# EAGLE design usb_blaster (EAGLE 7.3.0)
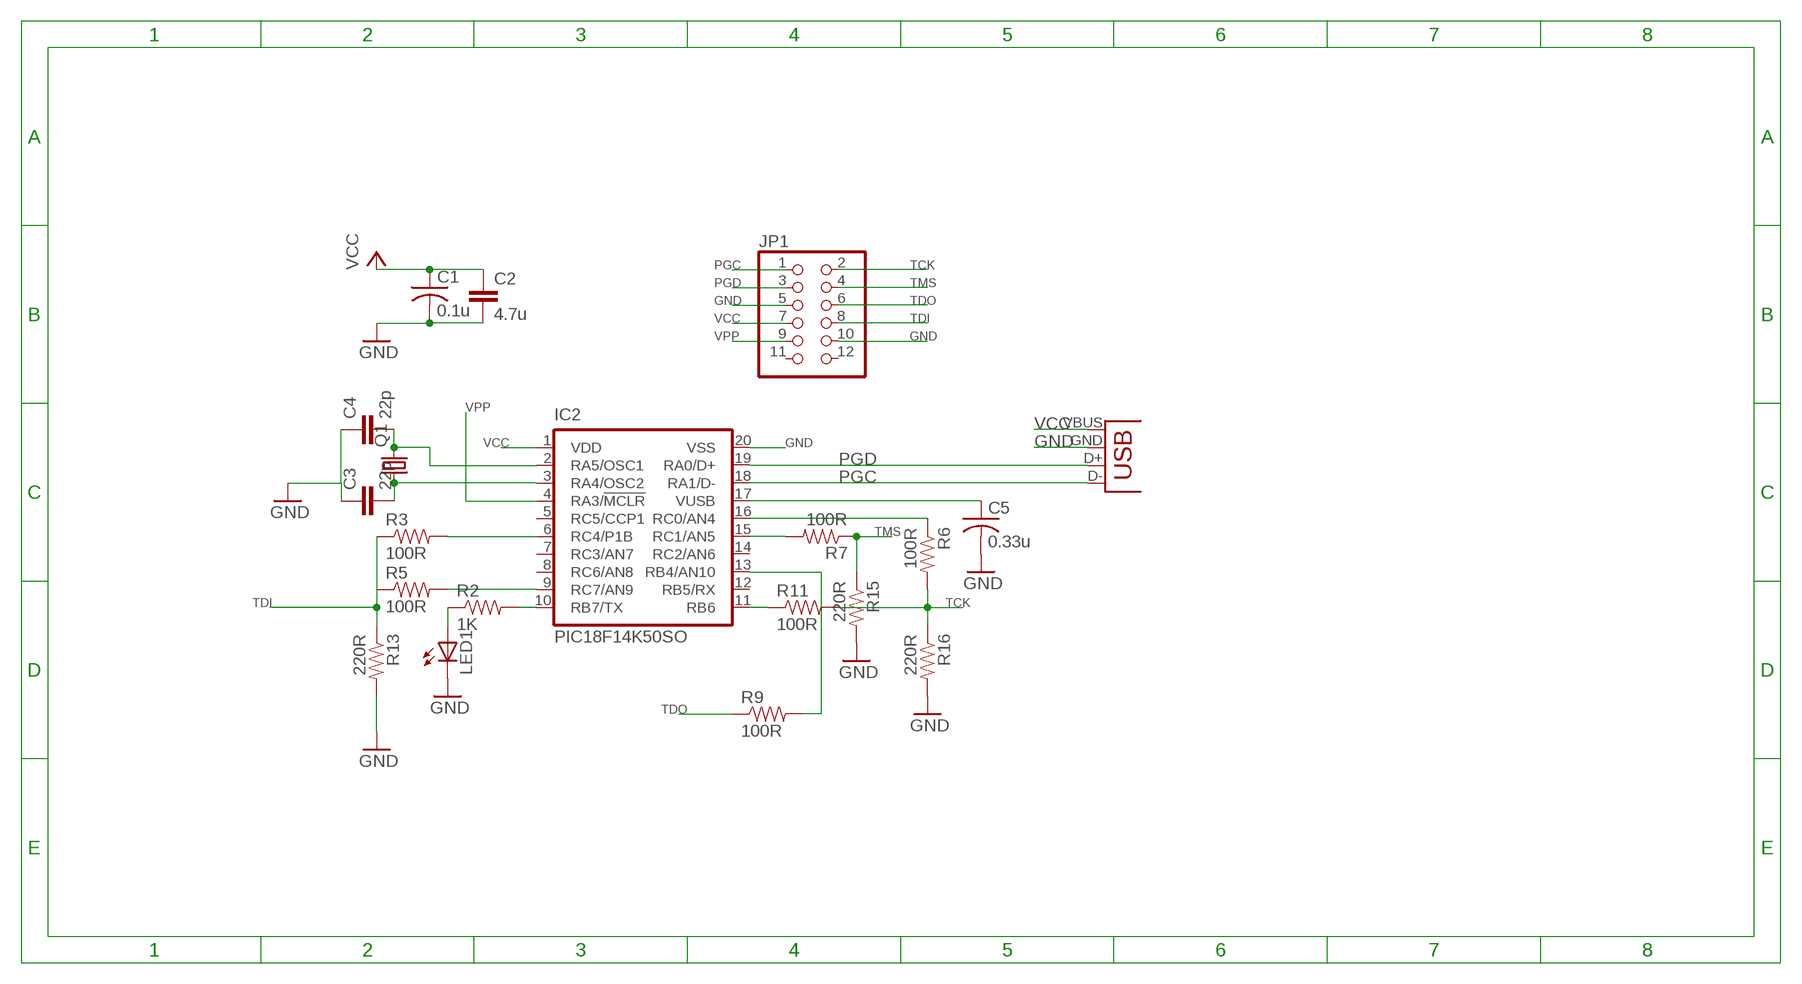
[diagram p0: schematic, sheet 1]

## Parts
C1  0.1u  C-USC0603K  [C0603K]
C2  4.7u  CAP0805  [0805]
C3  22p  CAP0805  [0805]
C4  22p  CAP0805  [0805]
C5  0.33u  C-USC0603K  [C0603K]
IC2  PIC18F14K50SO  [SO20]
JP1  PINHD-2X6  [2X06]
LED1  LEDCHIP-LED0805  [CHIP-LED0805]
Q1  CRYSTALHC49UP  [HC49UP]
R2  1K  RESISTOR0805-RES  [0805]
R3  100R  RESISTOR0805-RES  [0805]
R5  100R  RESISTOR0805-RES  [0805]
R6  100R  RESISTOR0805-RES  [0805]
R7  100R  RESISTOR0805-RES  [0805]
R9  100R  RESISTOR0805-RES  [0805]
R11  100R  RESISTOR0805-RES  [0805]
R13  220R  RESISTOR0805-RES  [0805]
R15  220R  RESISTOR0805-RES  [0805]
R16  220R  RESISTOR0805-RES  [0805]
X2  USB-A-H  [USB-A-H]

## Nets
GND: C1.2 C2.2 C3.1 C4.1 C5.2 IC2.20(VSS) JP1.5 JP1.10 LED1.C R13.2 R15.2 R16.2 X2.GND(VBUS)
N$1: C4.2 IC2.2(RA5/OSC1) Q1.2
N$2: IC2.15(RC1/AN5) R7.2
N$4: C3.2 IC2.3(RA4/OSC2) Q1.1
N$6: IC2.16(RC0/AN4) R6.1
N$7: IC2.13(RB4/AN10) R9.2
N$8: IC2.6(RC4/P1B) R3.2
N$12: C5.1 IC2.17(VUSB)
N$13: IC2.9(RC7/AN9) R5.2
N$14: IC2.10(RB7/TX) R2.2
N$15: LED1.A R2.1
N$16: IC2.11(RB6) R11.1
PGC: IC2.18(RA1/D-) JP1.1 X2.D-(D+)
PGD: IC2.19(RA0/D+) JP1.3 X2.D+(D-)
TCK: JP1.2 R6.2 R11.2 R16.1
TDI: JP1.8 R3.1 R5.1 R13.1
TDO: JP1.6 R9.1
TMS: JP1.4 R7.1 R15.1
VCC: C1.1 C2.1 IC2.1(VDD) JP1.7 X2.VBUS(GND)
VPP: IC2.4(RA3/!MCLR!) JP1.9
Unconnected: IC2.5(RC5/CCP1) IC2.7(RC3/AN7) IC2.8(RC6/AN8) IC2.12(RB5/RX) IC2.14(RC2/AN6) JP1.11 JP1.12

## Library data of the parts
C1 C5 = rcl:C-US: CAPACITOR, American symbol
C2-C4 = SparkFun:CAP: Capacitor Standard 0603 ceramic capacitor, and 0.1" leaded capacitor.
IC2 = pic18f14k50:PIC18F14K50
JP1 = pinhead:PINHD-2X6: PIN HEADER
LED1 = led:LED: LED OSRAM: - CHIPLED LG R971, LG N971, LY N971, LG Q971, LY Q971, LO R971, LY R971 LH N974, LH R974 LS Q976, LO Q976, LY Q976 LO Q996 - Hyper CHIPLED LW Q18S LB Q993, LB Q99A, LB R99A - SideLED LS A670, LO A670, LY A670, LG A670, LP A670 LB A673, LV A673, LT A673, LW A673 LH A674 LY A675 LS A676, LA A676, LO A676, LY A676, LW A676 LS A679, LY A679, LG A679 - Hyper Micro SIDELED® LS Y876, LA Y876, LO Y876, LY Y876 LT Y87S - SmartLED LW L88C, LW L88S LB L89C, LB L89S, LG L890 LS L89K, LO L89K, LY L89K LS L896, LA L896, LO L896, LY L896 - TOPLED LS T670, LO T670, LY T670, LG T670, LP T670 LSG T670, LSP T670, LSY T670, LOP T670, LYG T670 LG T671, LOG T671, LSG T671 LB T673, LV T673, LT T673, LW T673 LH T674 LS T676, LA T676, LO T676, LY T676, LB T676, LH T676, LSB T676, LW T676 LB T67C, LV T67C, LT T67C, LS T67K, LO T67K, LY T67K, LW E67C LS E67B, LA E67B, LO E67B, LY E67B, LB E67C, LV E67C, LT E67C LW T67C LS T679, LY T679, LG T679 LS T770, LO T770, LY T770, LG T770, LP T770 LB T773, LV T773, LT T773, LW T773 LH T774 LS E675, LA E675, LY E675, LS T675 LS T776, LA T776, LO T776, LY T776, LB T776 LHGB T686 LT T68C, LB T68C - Hyper Mini TOPLED® LB M676 - Mini TOPLED Santana® LG M470 LS M47K, LO M47K, LY M47K Source: http://www.osram.convergy.de LUXEON: - LUMILED® LXK2-PW12-R00, LXK2-PW12-S00, LXK2-PW14-U00, LXK2-PW14-V00 LXK2-PM12-R00, LXK2-PM12-S00, LXK2-PM14-U00 LXK2-PE12-Q00, LXK2-PE12-R00, LXK2-PE12-S00, LXK2-PE14-T00, LXK2-PE14-U00 LXK2-PB12-K00, LXK2-PB12-L00, LXK2-PB12-M00, LXK2-PB14-N00, LXK2-PB14-P00, LXK2-PB14-Q00 LXK2-PR12-L00, LXK2-PR12-M00, LXK2-PR14-Q00, LXK2-PR14-R00 LXK2-PD12-Q00, LXK2-PD12-R00, LXK2-PD12-S00 LXK2-PH12-R00, LXK2-PH12-S00 LXK2-PL12-P00, LXK2-PL12-Q00, LXK2-PL12-R00 Source: www.luxeon.com KINGBRIGHT: KA-3528ASYC Source: www.kingbright.com
Q1 = crystal:CRYSTAL: CRYSTAL; OC_FARNELL: unknown; OC_NEWARK: unknown
R2 R3 R5-R7 R9 R11 R13 R15 R16 = SparkFun:RESISTOR: Resistor Basic schematic elements and footprints for 0603, 1206, and PTH resistors.
X2 = usb:USB: USB Connectors USB-B-PTH is fully proven SKU : PRT-00139 USB-miniB is fully proven SKU : PRT-00587 USB-A-PCB is untested. USB-A-H is throughly reviewed, but untested. Spark Fun Electronics SKU : PRT-00437 USB-B-SMT is throughly reviewed, but untested. Needs silkscreen touching up. USB-A-S has not been used/tested USB-MB-H has not been used/tested

## Board
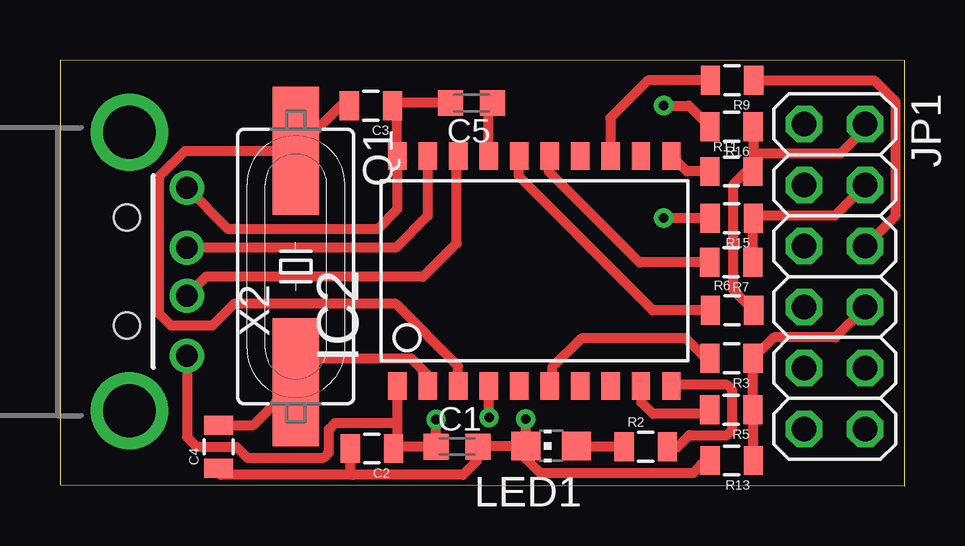
[diagram p1: board, top side]
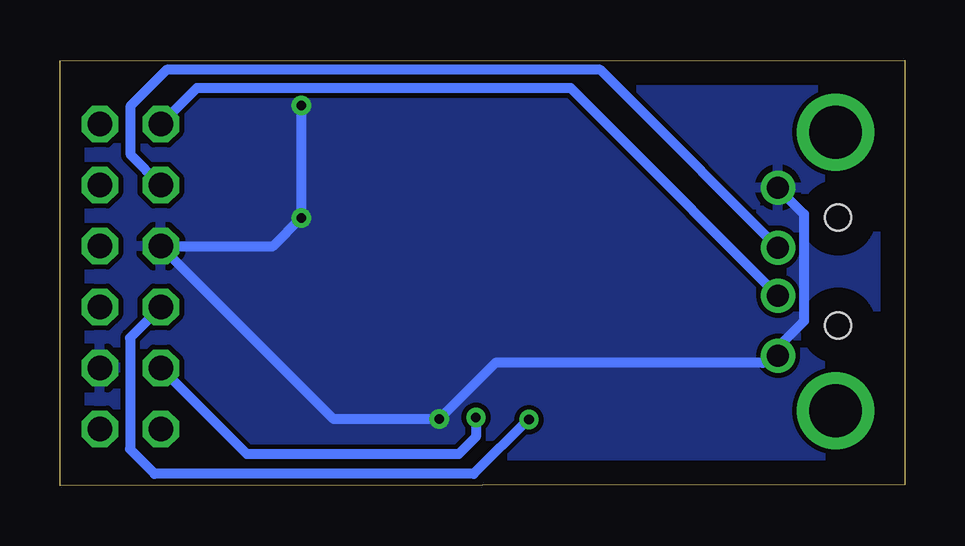
[diagram p2: board, bottom side, seen from below]

Size 35.23 x 17.72 mm. Coordinates in mm from the lower left corner, seen from the top.
Outline: 0,0.02 35.23,0 35.23,17.69 0,17.72 0,0.02
Copper layers (1*16): Top 0.035mm / dielectric 1.5mm / Bottom 0.035mm
Design rules "default": minimum track width 10mil, minimum drill 24mil, track to track 8mil, track to pad 8mil, pad to pad 8mil, via to via 8mil, smd to smd 8mil, copper to edge 40mil, drill to drill 8mil, minimum pad ring 10mil, minimum via ring 8mil, stop-mask expansion 4mil, vias tented up to drill 0mil, thermal gap 10mil

### Footprints (pad centres in the part's own frame; a part is rotated, then mirrored left to right if it is on the bottom)
C0603K = smd 1.05 x 1.08: 1 -0.875,0; 2 0.875,0
0805 = smd 0.8 x 1.2: 1 -0.9,0; 2 0.9,0
SO20 = smd 0.762 x 1.143: 1 -5.08,-4.788; 2 -3.81,-4.788; 3 -2.54,-4.788; 4 -1.27,-4.788; 5 0,-4.788; 6 1.27,-4.788; 7 2.54,-4.788; 8 3.81,-4.788; 9 5.08,-4.788; 10 6.35,-4.788; 11 6.35,4.788; 12 5.08,4.788; 13 3.81,4.788; 14 2.54,4.788; 15 1.27,4.788; 16 0,4.788; 17 -1.27,4.788; 18 -2.54,4.788; 19 -3.81,4.788; 20 -5.08,4.788
2X06 = drill 1.016 octagon: 1 -6.35,-1.27; 2 -6.35,1.27; 3 -3.81,-1.27; 4 -3.81,1.27; 5 -1.27,-1.27; 6 -1.27,1.27; 7 1.27,-1.27; 8 1.27,1.27; 9 3.81,-1.27; 10 3.81,1.27; 11 6.35,-1.27; 12 6.35,1.27
CHIP-LED0805 = smd 1.2 x 1.2: A 0,-1.05; C 0,1.05
HC49UP = smd 5.334 x 1.93: 1 -4.826,0; 2 4.826,0
USB-A-H = drill 0.914: D+ 2.4,1; D- 2.4,-1; GND 2.4,3.5; VBUS 2.4,-3.5 | drill 2.2: GND@1 0,5.8; GND@2 0,-5.8 | hole 1.1: -0.1,2.25; -0.1,-2.25

### Placement (x,y rotation side)
C1  16.56,1.62 0 top
C2  13,1.54 180 top
C3  12.96,15.83 180 top
C4  6.62,1.62 90 top
C5  17.15,15.94 180 top
IC2  19.14,8.94 0 top
JP1  32.3,8.71 270 top
LED1  20.48,1.65 90 top
Q1  9.83,9.13 270 top
R2  24.42,1.61 0 top
R3  27.99,5.3 180 top
R5  27.98,3.16 180 top
R6  28.02,7.3 0 top
R7  27.98,9.3 180 top
R9  28.01,16.88 180 top
R11  27.99,13.09 0 top
R13  28,1.05 180 top
R15  28.01,11.14 180 top
R16  28,14.95 180 top
X2  2.89,8.91 0 top

### Tracks (layer width: path | path; a pad name or v marks a point on that pad's centre or on a via)
GND  (via drill 0.4)
  Top 0.406: R13.2 26.91,1.05 26.38,0.51 20.03,0.51 19.45,1.1 19.45,1.63 LED1.C | 12.23,0.44 16.79,0.44 17.38,1.03 17.38,1.57 C1.2 17.46,1.65 LED1.C | C2.2 12.1,0.58 12.23,0.44 | 12.23,0.44 6.7,0.44 6.7,0.63 C4.1 | v25.17,15.83 26.21,15.83 R16.2 | v25.17,11.15 27.09,11.15 R15.2 | LED1.C v19.43,2.76 v19.42,2.77 | X2.GND 7.02,10.69 13.23,10.69 14.06,11.52 IC2.20 14.06,15.63 C3.1 13.97,15.94 C5.2
  Bottom 0.406: v25.17,15.83 v25.17,11.16 v25.17,11.15 26.34,9.98 JP1.5 23.82,2.77 v19.42,2.77 17.08,5.11 5.95,5.11 4.21,6.85 4.21,11.31 5.29,12.4 X2.GND
  pour Bottom: 0.33,17.33 34.92,17.33 34.97,17.28 34.97,0.4 35.02,0.35 0.33,0.35 0.33,17.24 0.37,17.28
N$1
  Top 0.406: IC2.2 15.33,4.61 14.65,5.29 10.81,5.29 Q1.2 8.04,2.52 C4.2
N$2
  Top 0.406: R7.2 24.16,9.3 20.39,13.08 20.39,13.7 IC2.15
N$4
  Top 0.406: C3.2 11.7,15.83 Q1.1 5.21,13.95 4.14,12.88 4.14,7.15 4.63,6.66 6.35,6.66 7.26,7.57 14,7.57 16.6,4.97 IC2.3
N$6
  Top 0.406: R6.1 24.72,7.3 19.13,12.89 19.13,13.72 IC2.16
N$7
  Top 0.406: R9.2 24.51,16.88 22.95,15.32 IC2.13
N$8
  Top 0.406: R3.2 26.94,5.3 26.1,6.13 21.73,6.13 20.52,4.92 20.52,4.26 IC2.6
N$12
  Top 0.406: IC2.17 17.87,15.79 C5.1
N$13
  Top 0.406: R5.2 26.89,2.98 24.73,2.98 24.24,3.47 24.24,4.14 IC2.9
N$14
  Top 0.406: R2.2 25.75,1.61 26.19,2.05 | 26.19,2.05 | 26.19,2.05 26.24,2.1 27.8,2.1 28.03,2.33 28.03,3.98 27.82,4.19 25.53,4.19 IC2.10
N$15
  Top 0.406: R2.1 21.57,1.61 LED1.A
N$16
  Top 0.406: R11.1 26.14,13.09 IC2.11
PGC
  Top 0.406: IC2.18 16.54,13.67 16.54,10.09 16.52,10.09 15.13,8.7 6.07,8.7 X2.D-
  Bottom 0.406: 12.44,15.06 X2.D- | 12.44,15.06 | 12.44,15.06 13.93,16.56 29.53,16.56 JP1.1
PGD
  Top 0.406: IC2.19 15.33,11.23 14.01,9.91 X2.D+
  Bottom 0.406: JP1.3 32.28,13.78 32.28,15.83 31.81,16.3 30.78,17.32 12.7,17.32 11.67,16.3 X2.D+
TCK
  Top 0.406: R16.1 28.9,13.83 | 28.9,13.83 28.9,13.1 R11.2 28.61,13.09 28.05,12.53 28.05,8.17 R6.2 | JP1.2 33.57,14.86 32.53,13.83 28.9,13.83
TDI
  Top 0.406: R13.1 28.9,3.14 R5.1 R3.1 29.77,6.17 32.33,6.17 33.57,7.4 JP1.8
TDO
  Top 0.406: R9.1 33.95,16.88 34.81,16.02 34.81,11.23 JP1.6
TMS
  Top 0.406: R7.1 28.88,11.12 R15.1 29.01,11.25 32.31,11.25 33.57,12.5 JP1.4
VCC  (via drill 0.4)
  Top 0.406: X2.VBUS 5.29,2.01 5.7,1.61 7.35,1.61 7.79,1.17 10.98,1.17 11.21,1.4 11.21,2.35 11.47,2.61 14.04,2.61 14.06,2.59 | IC2.1 14.06,2.59 | 14.06,2.59 14.06,1.7 C2.1 13.98,1.62 C1.1 v15.68,2.75
  Bottom 0.406: v15.68,2.75 15.72,2.75 17.98,0.49 31.29,0.49 32.31,1.51 32.31,6.15 JP1.7
VPP  (via drill 0.4)
  Top 0.406: IC2.4 17.87,2.86 v17.89,2.84
  Bottom 0.406: v17.89,2.84 17.89,2.03 18.61,1.31 27.43,1.31 JP1.9

### Text on the board
200bmp: C:/Users/erdem/Pictures/altera-jtag.bmp